# Altium schematic sheet Son_BU_ESP32_V1.SchDoc
size A3
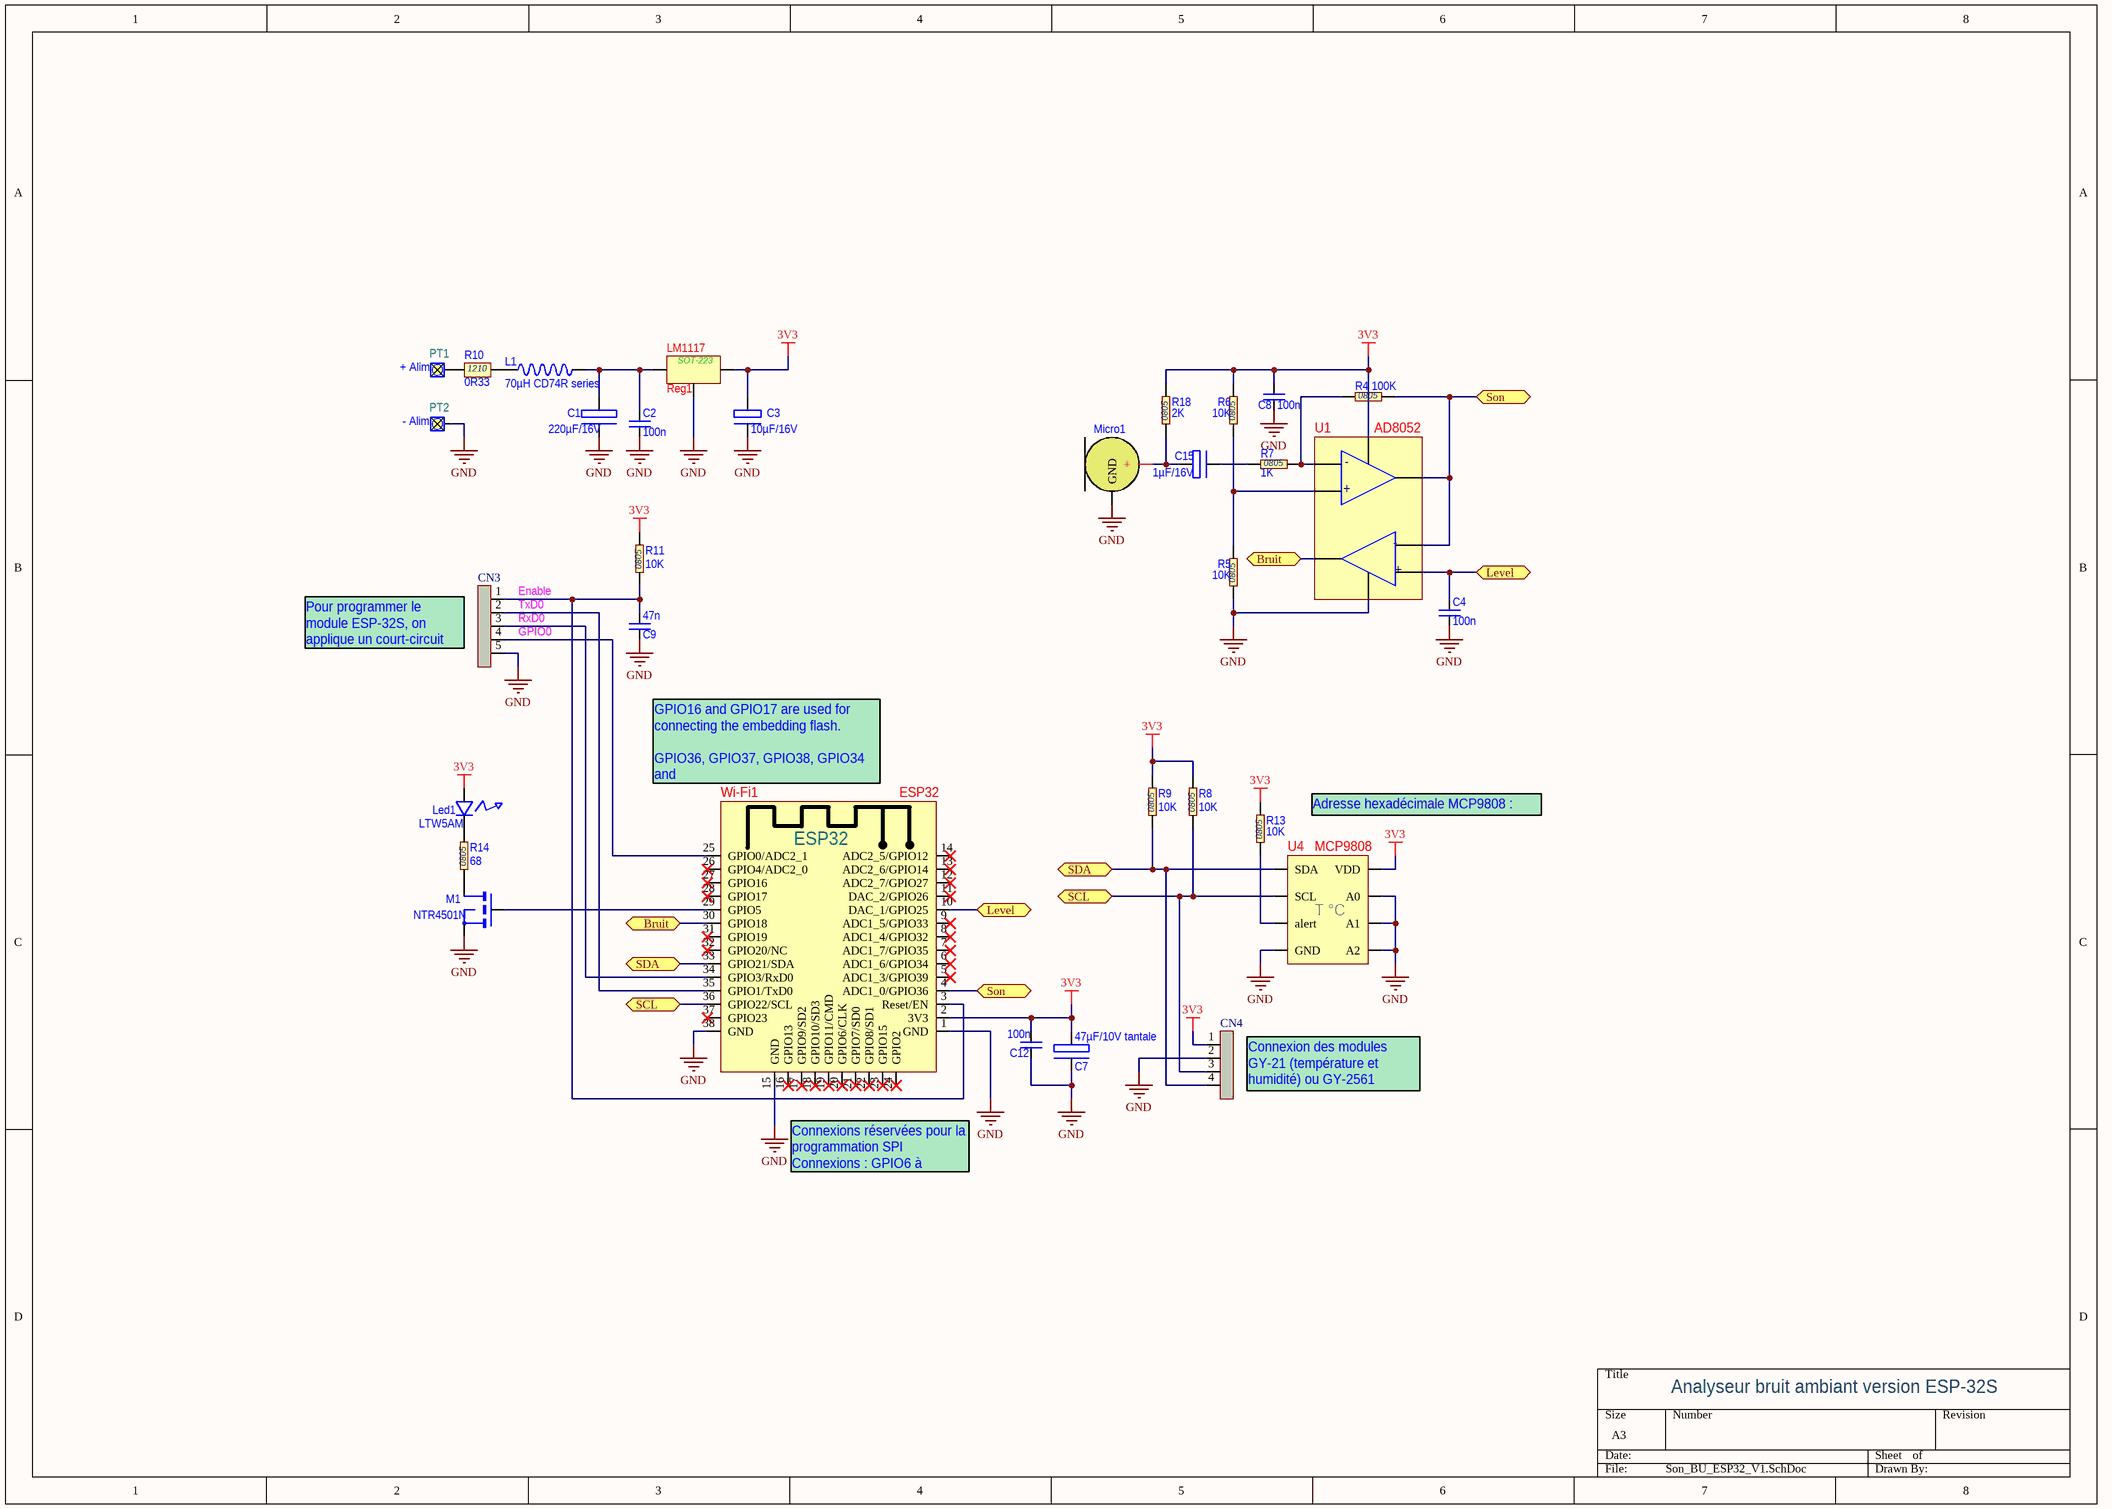
[diagram p0: Son_BU_ESP32_V1.SchDoc]

## Parts
C1  220µF/16V  [7343-31]
C2  100n  [0805]
C3  10µF/16V  [Tantale 10µF/16V]
C4  100n  [0805]
C7  47µF/10V tantale  [tantale 47µF/10V]
C8  100n  [0805]
C9  47n  [0805]
C12  100n  [0805]
C15  1µF/16V  [3216-18]
CN3  inch_ligne 1x5  [INCH_1x5_droit]  (value not drawn)
CN4  inch_ligne 1x4  [INCH_1x4_droit]  (value not drawn)
L1  70µH CD74R series  [SELF CD74R]
Led1  LTW5AM  [LTW5AM]
M1  NTR4501N  [SOT23 (NTR4501)]
Micro1  Electret  [Micro_electret simple]  (value not drawn)
PT1  + Alim  [Pointe de test]
PT2  - Alim  [Pointe de test]
R4  100K  [0805]
R5  10K  [0805]
R6  10K  [0805]
R7  1K  [0805]
R8  10K  [0805]
R9  10K  [0805]
R10  0R33  [1210]
R11  10K  [0805]
R13  10K  [0805]
R14  68  [0805]
R18  2K  [0805]
Reg1  LM1117  [SOT223]
U1  AD8052  [SOIC08]
U4  MCP9808  [MSOP-08]
Wi-Fi1  ESP32  [ESP32]

## Ports
Bruit, Level, SCL, SDA, Son

## Nets
3V3: C3.1(V+) C7.1(V+) C8.2(CT2) C12.2(CT2) CN4.1 Led1.1(anode) R6.2(CT2) R8.2(CT2) R9.2(CT2) R11.2(CT2) R13.2(CT2) R18.2(CT2) Reg1.2(OUT) U1.8(V+) U4.8(VDD) Wi-Fi1.2(3V3)
GND: C1.2(V-) C2.1(CT1) C3.2(V-) C4.1(CT1) C7.2(V-) C8.1(CT1) C9.1(CT1) C12.1(CT1) CN3.5 CN4.2 M1.3(S) Micro1.0(GND) PT2.1(PIN) R5.1(CT1) Reg1.1(GND) U1.4(V-) U4.4(GND) U4.5(A2) U4.6(A1) U4.7(A0) Wi-Fi1.1(GND) Wi-Fi1.15(GND) Wi-Fi1.38(GND)
Bruit: U1.7(out) Wi-Fi1.30(GPIO18) ; port Bruit
Enable: C9.2(CT2) CN3.1 R11.1(CT1) Wi-Fi1.3(Reset/EN)
GPIO0: CN3.4 Wi-Fi1.25(GPIO0/ADC2_1)
Level: C4.2(CT2) U1.5(in+) Wi-Fi1.10(DAC_1/GPIO25) ; port Level
RxD0: CN3.3 Wi-Fi1.34(GPIO3/RxD0)
SCL: CN4.3 R8.1(CT1) U4.2(SCL) Wi-Fi1.36(GPIO22/SCL) ; port SCL
SDA: CN4.4 R9.1(CT1) U4.1(SDA) Wi-Fi1.33(GPIO21/SDA) ; port SDA
Son: R4.2(CT2) U1.1(out) U1.6(in-) Wi-Fi1.4(ADC1_0/GPIO36) ; port Son
TxD0: CN3.2 Wi-Fi1.35(GPIO1/TxD0)
NetC1_1: C1.1(V+) C2.2(CT2) L1.1(CT1) Reg1.3(IN)
NetC15_1: C15.1(V+) Micro1.1(+) R18.1(CT1)
NetC15_2: C15.2(V-) R7.1(CT1)
NetL1_2: L1.2(CT2) R10.2(CT2)
NetLed1_2: Led1.2(cathode) R14.2(CT2)
NetM1_1: M1.1(D) R14.1(CT1)
NetM1_2: M1.2(G) Wi-Fi1.29(GPIO5)
NetPT1_1: PT1.1(PIN) R10.1(CT1)
NetR4_1: R4.1(CT1) R7.2(CT2) U1.2(in-)
NetR5_2: R5.2(CT2) R6.1(CT1) U1.3(in+)
NetR13_1: R13.1(CT1) U4.3(alert)

Not connected (* = marked no-connect by the designer): Wi-Fi1 5(ADC1_3/GPIO39)* 6(ADC1_6/GPIO34)* 7(ADC1_7/GPIO35)* 8(ADC1_4/GPIO32)* 9(ADC1_5/GPIO33)* 11(DAC_2/GPIO26)* 12(ADC2_7/GPIO27)* 13(ADC2_6/GPIO14)* 14(ADC2_5/GPIO12)* 16(GPIO13)* 17(GPIO9/SD2)* 18(GPIO10/SD3)* 19(GPIO11/CMD)* 20(GPIO6/CLK)* 21(GPIO7/SD0)* 22(GPIO8/SD1)* 23(GPIO15)* 24(GPIO2)* 26(GPIO4/ADC2_0)* 27(GPIO16)* 28(GPIO17)* 31(GPIO19)* 32(GPIO20/NC)* 37(GPIO23)*

## Notes on the sheet
- (near CN3) Pour programmer le module ESP-32S, on applique un court-circuit entre 4 et 5.
- GPIO16 and GPIO17 are used for
  connecting the embedding flash.
  GPIO36, GPIO37, GPIO38, GPIO34 and
  GPIO35 can only be used for input.
- Adresse hexadécimale MCP9808 : 0x3_
- (near CN4) Connexion des modules GY-21 (température et humidité) ou GY-2561 (Luxmètre)
- (near Wi-Fi1) Connexions réservées pour la programmation SPI
  Connexions : GPIO6 à GPIO11
- Analyseur bruit ambiant version ESP-32S
- (in symbol AD8052) -; +
- (in symbol LM1117/800mA) SOT-223
- (in symbol MCP9808) T °C
- (in symbol Res CMS 0805) 0805
- (in symbol Res CMS 1210 ERJ14B) 1210

## Library data of the parts
C1 = tantale 220µF/16V: 253-5290 case 7343-31
C2 C4 C8 C9 C12 = Cap_CMS_0805: CMS 0805
C3 = tantale 10µF/16V: 145-7461 case 3216-18
C7 = tantale 47µF/10V: 175-4168
C15 = tantale 1µF/16V: 145-7406 case 3216-18
CN3 = Inch_1x5_droit
CN4 = Inch_1x4_droit
L1 = Self CD74R: SMT CD74R Aliexpress
Led1 = LTW5AM LED: LED Golden Dragon Plus
M1 = NTR4501N: MOSFET canal N
Micro1 = Microphone_03: Microphone électret
PT1 PT2 = PTEST: pointe de test CI 133-6225
R4-R9 R11 R13 R14 R18 = Res CMS 0805: CMS 0805
R10 = Res CMS 1210 ERJ14B: CMS 1210
Reg1 = LM1117/800mA: Régulateur SOT-223
U1 = AD8052: AOP
U4 = MCP9808: Digital temperature Sensor
Wi-Fi1 = ESP32: ESP32 module µC Bluetooth Wi-Fi